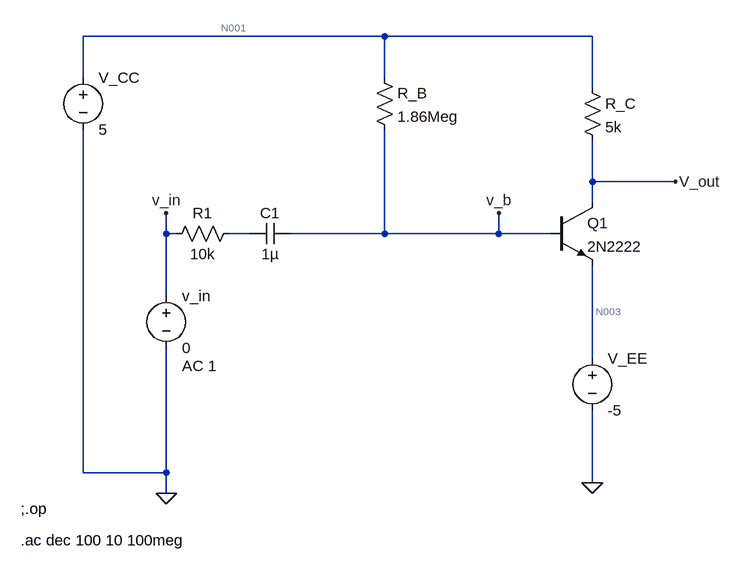
[diagram p0: schematic amplification_stage_1.asc]
amplification_stage_1.asc, the LTspice schematic file:
Version 4
SHEET 1 880 680
WIRE 176 -112 -288 -112
WIRE 496 -112 176 -112
WIRE -288 -48 -288 -112
WIRE 176 -48 176 -112
WIRE 496 -32 496 -112
WIRE 496 112 496 48
WIRE 624 112 496 112
WIRE 496 144 496 112
WIRE -160 192 -160 160
WIRE -144 192 -160 192
WIRE -32 192 -64 192
WIRE 176 192 176 32
WIRE 176 192 32 192
WIRE 352 192 352 160
WIRE 352 192 176 192
WIRE 432 192 352 192
WIRE -160 288 -160 192
WIRE 496 384 496 240
WIRE -288 560 -288 32
WIRE -160 560 -160 368
WIRE -160 560 -288 560
WIRE 496 576 496 464
WIRE -160 592 -160 560
FLAG 624 112 V_out
FLAG -160 160 v_in
FLAG 352 160 v_b
FLAG -160 592 0
FLAG 496 576 0
SYMBOL voltage -288 -64 R0
WINDOW 123 0 0 Left 0
WINDOW 39 0 0 Left 0
SYMATTR InstName V_CC
SYMATTR Value 5
SYMBOL res 160 -64 R0
SYMATTR InstName R_B
SYMATTR Value 1.86Meg
SYMBOL res 480 -48 R0
SYMATTR InstName R_C
SYMATTR Value 5k
SYMBOL cap 32 176 R90
WINDOW 0 0 32 VBottom 2
WINDOW 3 32 32 VTop 2
SYMATTR InstName C1
SYMATTR Value 1µ
SYMBOL npn 432 144 R0
SYMATTR InstName Q1
SYMATTR Value 2N2222
SYMBOL voltage -160 272 R0
WINDOW 123 24 124 Left 2
WINDOW 39 0 0 Left 0
SYMATTR InstName v_in
SYMATTR Value 0
SYMATTR Value2 AC 1
SYMBOL voltage 496 368 R0
SYMATTR InstName V_EE
SYMATTR Value -5
SYMBOL res -48 176 R90
WINDOW 0 0 56 VBottom 2
WINDOW 3 32 56 VTop 2
SYMATTR InstName R1
SYMATTR Value 10k
TEXT -384 616 Left 2 !;.op
TEXT -384 664 Left 2 !.ac dec 100 10 100meg

The netlist it stands for:
* amplification_stage_1.asc
V_CC N001 0 5
R_B N001 v_b 1.86Meg
R_C N001 V_out 5k
C1 v_b N002 1µ
Q1 V_out v_b N003 0 2N2222
v_in v_in 0 0 AC 1
V_EE N003 0 -5
R1 N002 v_in 10k
.model NPN NPN
.model PNP PNP
.lib standard.bjt
;.op
.ac dec 100 10 100meg
.backanno
.end

* Results of the author's LTspice run, read from the files saved beside the schematic
* Operating Point, zero values left out:
*   V(n001) = 5 V
*   V(v_b) = -4.344 V
*   V(v_out) = -214 mV
*   V(n003) = -5 V
*   Ic(Q1) = 1.043 mA
*   Ib(Q1) = 5.024 µA
*   Ie(Q1) = -1.048 mA
*   I(R_c) = 1.043 mA
*   I(R_b) = 5.024 µA
*   I(V_ee) = 1.048 mA
*   I(V_cc) = -1.048 mA
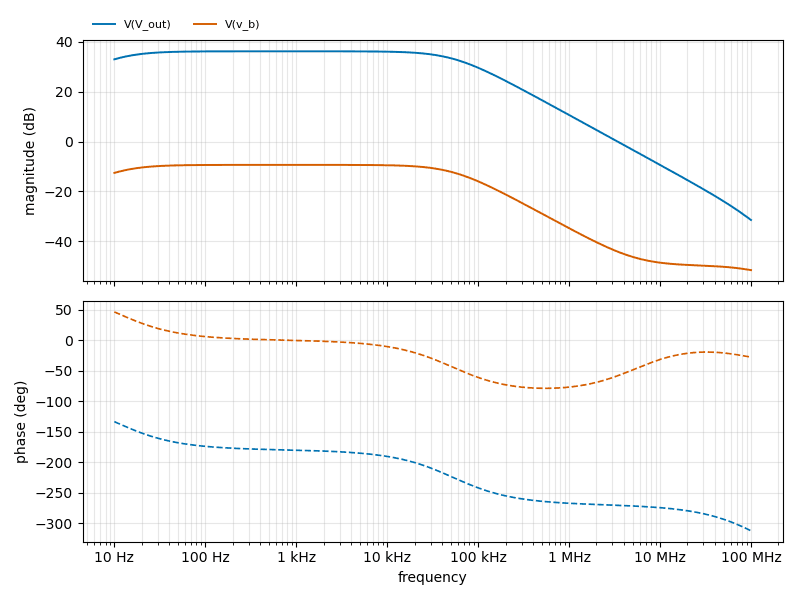
[diagram p1: AC Analysis of amplification_stage_1.asc, plotted from the saved traces]
* AC Analysis, 1 run:
*   V(V_out): 33.00 dB at 10 Hz, -31.45 dB at 100 MHz, peak 36.21 dB at 741.3 Hz, 3 dB below the peak at 10.48 Hz and 52.89 kHz
*   V(v_b): -12.56 dB at 10 Hz, -51.57 dB at 100 MHz, peak -9.34 dB at 741.3 Hz, 3 dB below the peak at 10.48 Hz and 52.9 kHz